# EAGLE design ic555-astable (EAGLE 7.7.0)
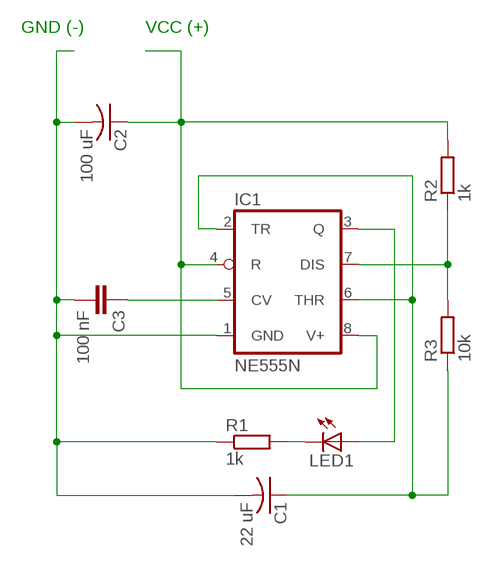
[diagram p0: schematic, sheet 1]

## Parts
C1  22 uF  C-US050-035X075  [C050-035X075]
C2  100 uF  C-US050-035X075  [C050-035X075]
C3  100 nF  C-EU050-035X075  [C050-035X075]
IC1  NE555N  [DIL08]
LED1  LED5MM  [LED5MM]
R1  1k  R-EU_0204/7  [0204/7]
R2  1k  R-EU_0204/7  [0204/7]
R3  10k  R-EU_0204/7  [0204/7]

## Nets
N$1: C1.1 IC1.2(TR) IC1.6(THR) R3.1
N$2: IC1.7(DIS) R2.1 R3.2
N$4: C1.2 C2.2 C3.2 IC1.1(GND) R1.1
N$5: IC1.3(Q) LED1.A
N$6: LED1.K(C) R1.2
N$7: C2.1 IC1.4(R) IC1.8(V+) R2.2
N$8: C3.1 IC1.5(CV)

## Notes on the sheet
- GND (-) | VCC (+)

## Library data of the parts
C1 C2 = resistor:C-US: CAPACITOR, American symbol
C3 = resistor:C-EU: CAPACITOR, European symbol
IC1 = linear:*555: TIMER
LED1 = led:LED: LED OSRAM: - CHIPLED LG R971, LG N971, LY N971, LG Q971, LY Q971, LO R971, LY R971 LH N974, LH R974 LS Q976, LO Q976, LY Q976 LO Q996 - Hyper CHIPLED LW Q18S LB Q993, LB Q99A, LB R99A - SideLED LS A670, LO A670, LY A670, LG A670, LP A670 LB A673, LV A673, LT A673, LW A673 LH A674 LY A675 LS A676, LA A676, LO A676, LY A676, LW A676 LS A679, LY A679, LG A679 - Hyper Micro SIDELED® LS Y876, LA Y876, LO Y876, LY Y876 LT Y87S - SmartLED LW L88C, LW L88S LB L89C, LB L89S, LG L890 LS L89K, LO L89K, LY L89K LS L896, LA L896, LO L896, LY L896 - TOPLED LS T670, LO T670, LY T670, LG T670, LP T670 LSG T670, LSP T670, LSY T670, LOP T670, LYG T670 LG T671, LOG T671, LSG T671 LB T673, LV T673, LT T673, LW T673 LH T674 LS T676, LA T676, LO T676, LY T676, LB T676, LH T676, LSB T676, LW T676 LB T67C, LV T67C, LT T67C, LS T67K, LO T67K, LY T67K, LW E67C LS E67B, LA E67B, LO E67B, LY E67B, LB E67C, LV E67C, LT E67C LW T67C LS T679, LY T679, LG T679 LS T770, LO T770, LY T770, LG T770, LP T770 LB T773, LV T773, LT T773, LW T773 LH T774 LS E675, LA E675, LY E675, LS T675 LS T776, LA T776, LO T776, LY T776, LB T776 LHGB T686 LT T68C, LB T68C - Hyper Mini TOPLED® LB M676 - Mini TOPLED Santana® LG M470 LS M47K, LO M47K, LY M47K Source: http://www.osram.convergy.de LUXEON: - LUMILED® LXK2-PW12-R00, LXK2-PW12-S00, LXK2-PW14-U00, LXK2-PW14-V00 LXK2-PM12-R00, LXK2-PM12-S00, LXK2-PM14-U00 LXK2-PE12-Q00, LXK2-PE12-R00, LXK2-PE12-S00, LXK2-PE14-T00, LXK2-PE14-U00 LXK2-PB12-K00, LXK2-PB12-L00, LXK2-PB12-M00, LXK2-PB14-N00, LXK2-PB14-P00, LXK2-PB14-Q00 LXK2-PR12-L00, LXK2-PR12-M00, LXK2-PR14-Q00, LXK2-PR14-R00 LXK2-PD12-Q00, LXK2-PD12-R00, LXK2-PD12-S00 LXK2-PH12-R00, LXK2-PH12-S00 LXK2-PL12-P00, LXK2-PL12-Q00, LXK2-PL12-R00 Source: www.luxeon.com KINGBRIGHT: KA-3528ASYC Source: www.kingbright.com
R1-R3 = resistor:R-EU_: RESISTOR, European symbol

## Board
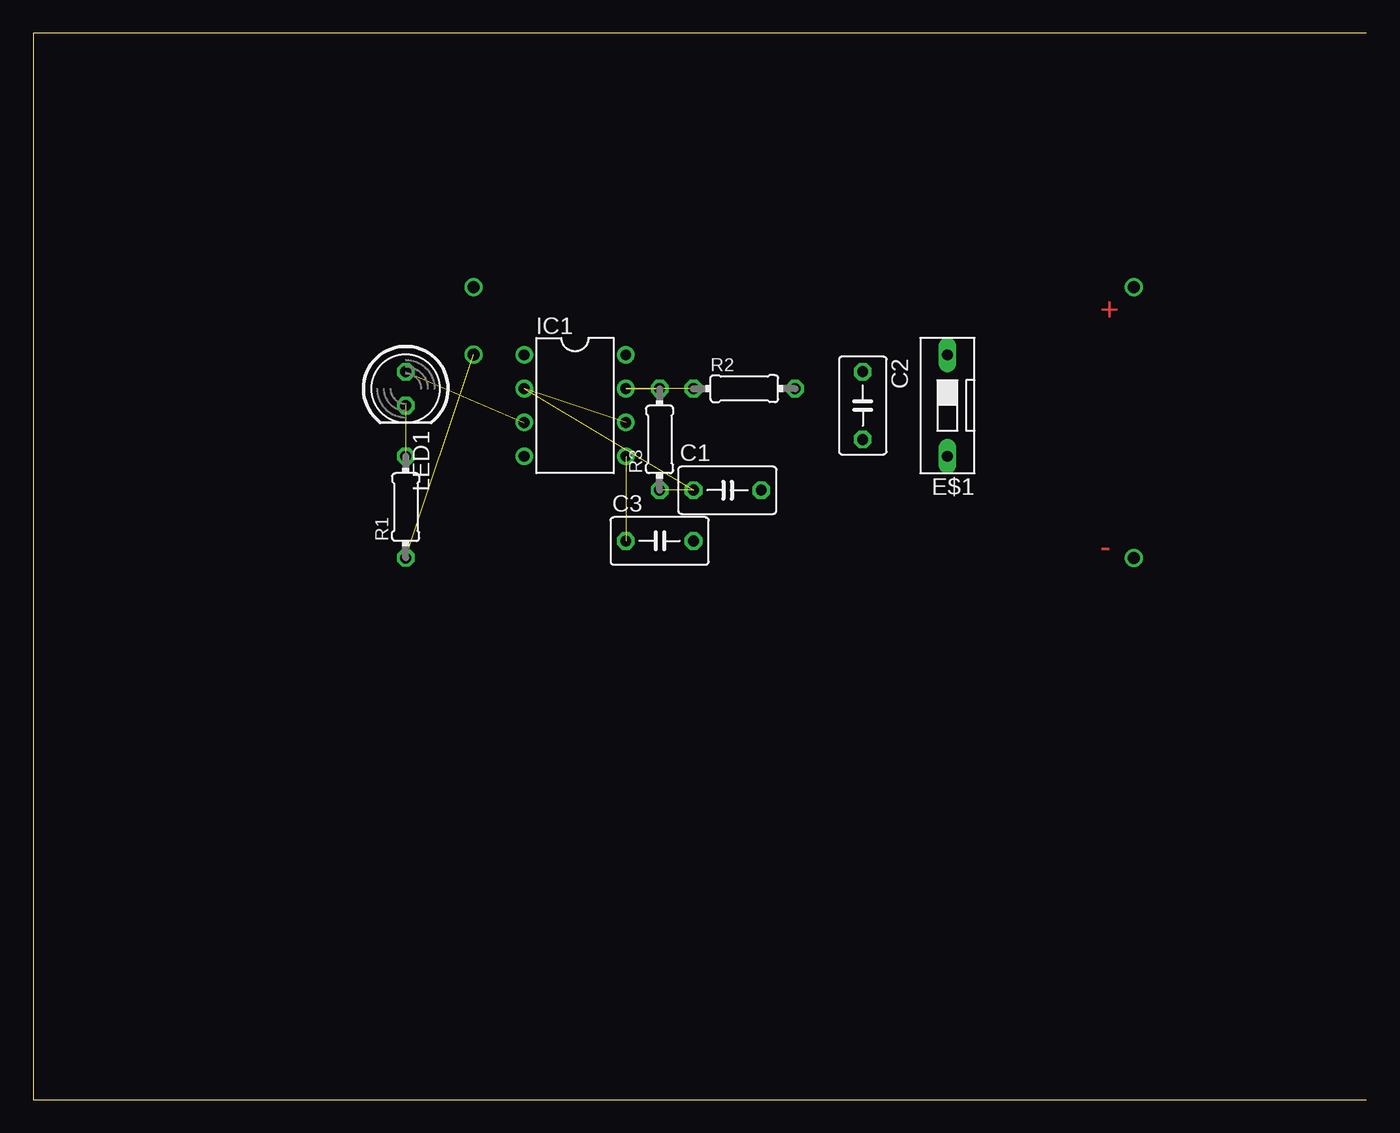
[diagram p1: board, top side]
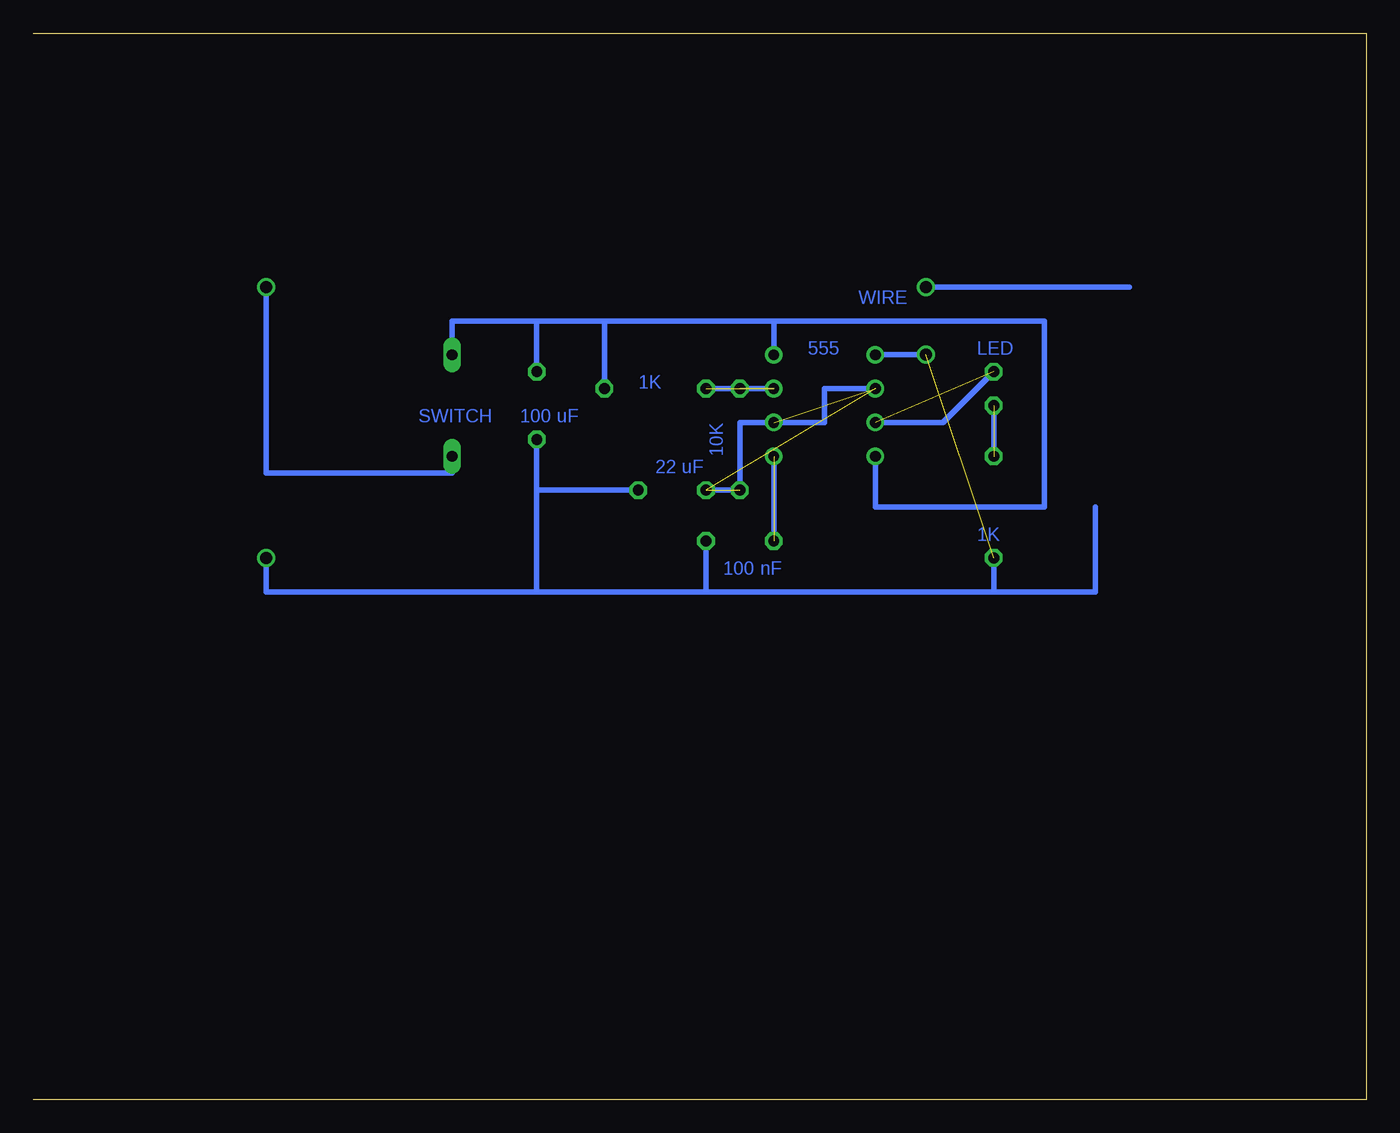
[diagram p2: board, bottom side, seen from below]

Size 100 x 80 mm. Coordinates in mm from the lower left corner, seen from the top.
Outline: 100,0 0,0 0,80 100,80
Copper layers (1*16): Top 0.035mm / dielectric 1.5mm / Bottom 0.035mm
Design rules "default": minimum track width 10mil, minimum drill 24mil, track to track 8mil, track to pad 8mil, pad to pad 8mil, via to via 8mil, smd to smd 8mil, copper to edge 40mil, drill to drill 8mil, minimum pad ring 10mil, minimum via ring 8mil, stop-mask expansion 4mil, vias tented up to drill 0mil, thermal gap 10mil

### Footprints (pad centres in the part's own frame; a part is rotated, then mirrored left to right if it is on the bottom)
C050-035X075 = drill 0.813 octagon: 1 -2.54,0; 2 2.54,0
DS-01 = drill 0.813 long: 1 0,-3.81; 2 0,3.81
DIL08 = drill 0.813 pad 1.27: 1 -3.81,-3.81; 2 -1.27,-3.81; 3 1.27,-3.81; 4 3.81,-3.81; 5 3.81,3.81; 6 1.27,3.81; 7 -1.27,3.81; 8 -3.81,3.81
LED5MM = drill 0.813 octagon: A -1.27,0; K 1.27,0
0204/7 = drill 0.813 octagon: 1 -3.81,0; 2 3.81,0

### Placement (x,y rotation side)
C1  52.07,45.72 0 top
C2  62.23,52.07 270 top
C3  46.99,41.91 0 top
E$1  [DS-01]  68.58,52.07 180 top
IC1  40.64,52.07 270 top
LED1  27.94,53.34 270 top
R1  27.94,44.45 90 top
R2  53.34,53.34 0 top
R3  46.99,49.53 90 top

### Tracks (layer width: path | path; a pad name or v marks a point on that pad's centre or on a via)
N$1  (3 unrouted)
  Bottom 0.406: IC1.2 40.64,53.34 40.64,50.8 IC1.6 46.99,50.8 R3.1 C1.1
N$2  (2 unrouted)
  Bottom 0.406: IC1.7 R3.2 R2.1
N$3  (via drill 0.9)
  Bottom 0.406: 68.58,46.99 82.55,46.99 v82.55,60.96
N$4  (via drill 0.9)  (1 unrouted)
  Bottom 0.406: 62.23,38.1 82.55,38.1 v82.55,40.64 | 62.23,38.1 49.53,38.1 | 49.53,38.1 27.94,38.1 | 27.94,38.1 R1.1 | C2.2 62.23,45.72 | 62.23,45.72 62.23,38.1 | C3.2 49.53,38.1 | C1.2 62.23,45.72 | IC1.1 v33.02,55.88 | 27.94,38.1 20.32,38.1 20.32,44.45
N$5  (1 unrouted)
  Bottom 0.406: IC1.3 31.75,50.8 LED1.A
N$6  (1 unrouted)
  Bottom 0.406: R1.2 LED1.K
N$7
  Bottom 0.406: 62.23,58.42 C2.1 | IC1.8 44.45,58.42 | 44.45,58.42 57.15,58.42 | 57.15,58.42 62.23,58.42 | IC1.4 36.83,44.45 24.13,44.45 24.13,58.42 44.45,58.42 | R2.2 57.15,58.42 | 68.58,57.15 68.58,58.42 62.23,58.42
N$8  (1 unrouted)
  Bottom 0.406: IC1.5 C3.1
S$1  (via drill 0.9)
  Bottom 0.406: 17.78,60.96 v33.02,60.96

### Text on the board
Top: + | -
Bottom: WIRE | LED | 555 | 1K | 100 uF | SWITCH | 10K | 22 uF | 1K | 100 nF
200bmp: 2017